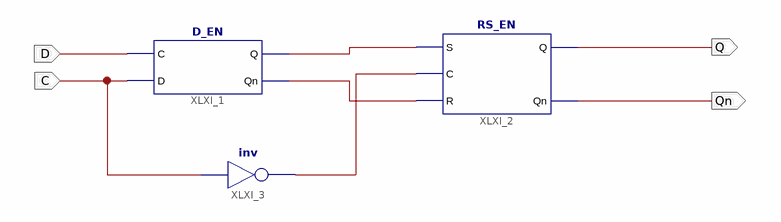
[diagram p0: schematic sheet 1]
// Xilinx ISE schematic D_Trig.sch (kintex7) as structural Verilog: 3 symbols, 4 ports
module D_Trig (
  input  D,
  input  C,
  output Q,
  output Qn
);

  wire XLXN_3, XLXN_4, XLXN_8;

  D_EN XLXI_1 (.C(D), .D(C), .Q(XLXN_3), .Qn(XLXN_4));
  RS_EN XLXI_2 (.S(XLXN_3), .C(XLXN_8), .R(XLXN_4), .Q(Q), .Qn(Qn));
  not XLXI_3 (XLXN_8, C);
endmodule
